# Altium schematic sheet PotentiometerDaughter.SchDoc
size Letter; SheetNumber: 1; SheetTotal: 1
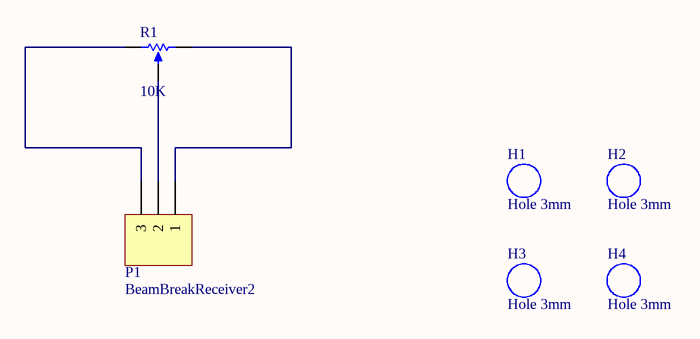
[diagram p0: PotentiometerDaughter.SchDoc]

## Parts
H1  Hole 3mm  [Hole 3mm]
H2  Hole 3mm  [Hole 3mm]
H3  Hole 3mm  [Hole 3mm]
H4  Hole 3mm  [Hole 3mm]
P1  BeamBreakReceiver2  [HDR1X3]
R1  value 10K  [POT OFFSET 400]  (hidden comment: RPot_4)

## Nets
NetP1_1: P1.1 R1.3(BOT)
NetP1_2: P1.2 R1.2(TAP)
NetP1_3: P1.3 R1.1(TOP)

## Library data of the parts
P1 = Header 3: Header, 3-Pin; LatestRevisionDate: 17-Jul-2002; LatestRevisionNote: Re-released for DXP Platform.; Publisher: Altium Limited
R1 = RPot_2: Potentiometer; Sim Note: Enter the Resistance value and the set point into parameter fields.; Set Position: 0.5; Published: 8-Jun-2000; LatestRevisionDate: 17-Jul-2002; LatestRevisionNote: Re-released for DXP Platform.; PackageReference: VR5; Publisher: Altium Limited; PackageDescription: Variable Resistor, Thru-Hole; 3 Leads